# Altium schematic sheet [1] COVER PAGE.SchDoc
size 300 x 200 mm
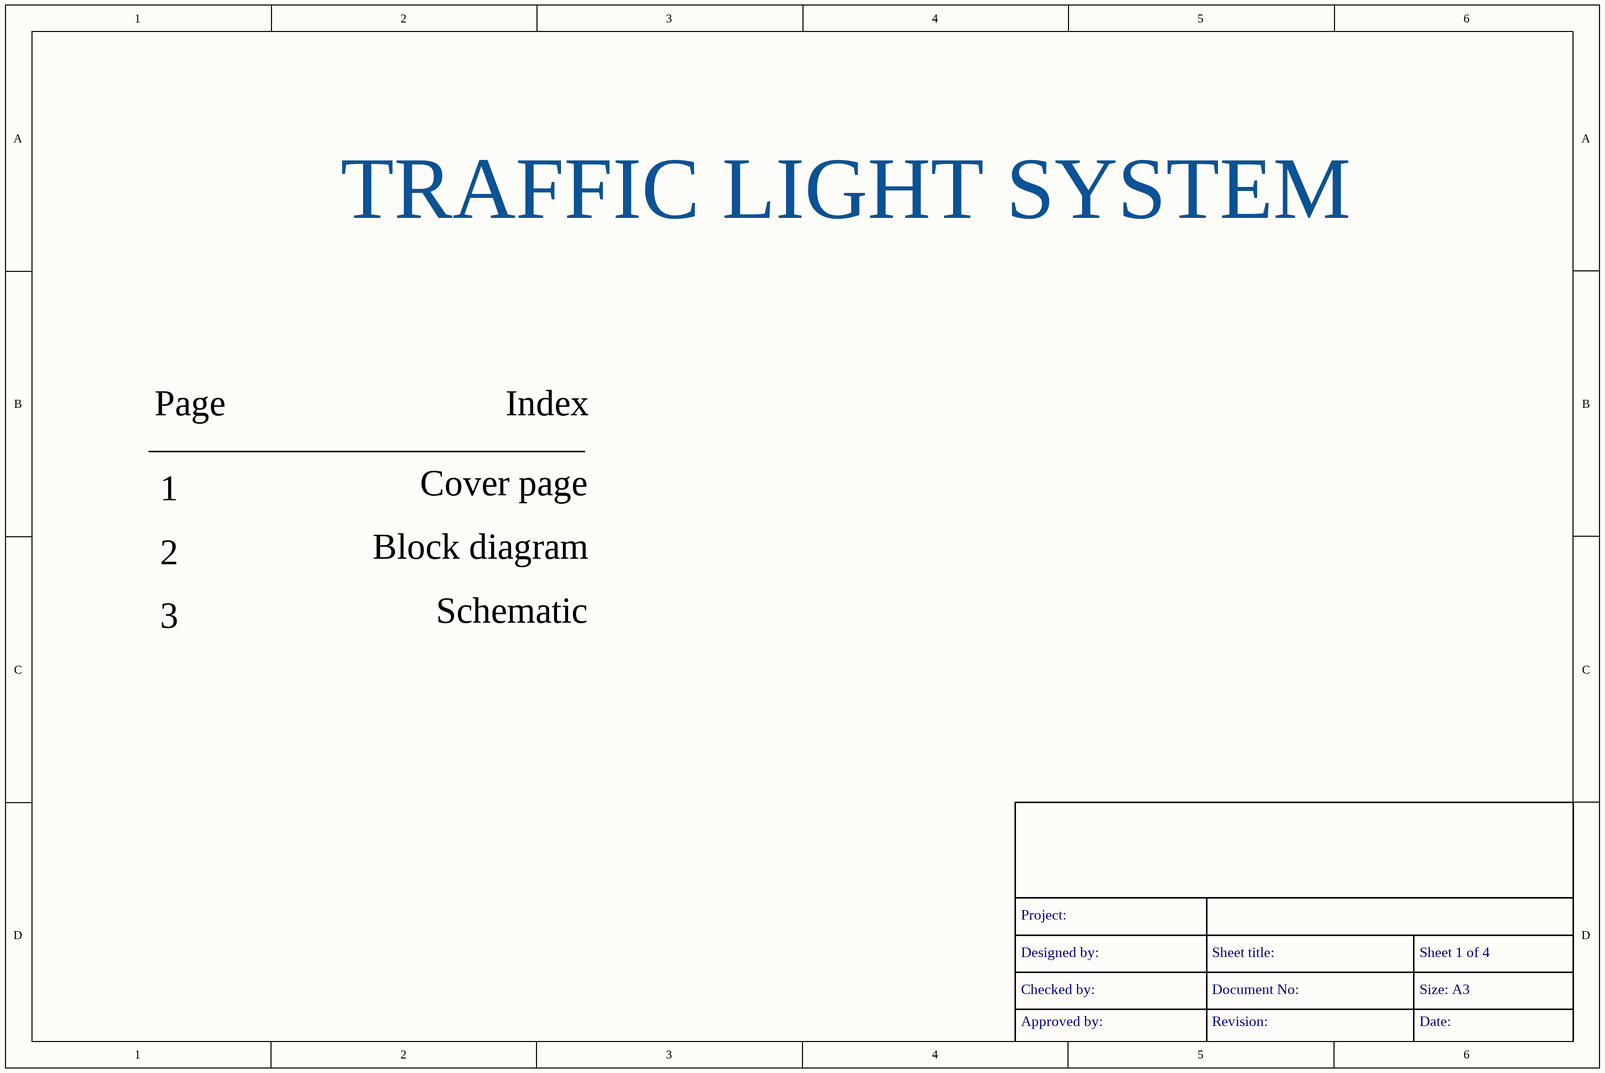
[diagram p0: [1] COVER PAGE.SchDoc]

## Notes on the sheet
- TRAFFIC LIGHT SYSTEM
- Page
- Index
- 1
- Cover page
- 2
- Block diagram
- 3
- Schematic
- Project:
- Designed by:
- Sheet title:
- Sheet 1 of 4
- Approved by:
- Checked by:
- Document No:
- Revision:
- Size: A3
- Date: